# EAGLE board led_3 (EAGLE 9.4.1)
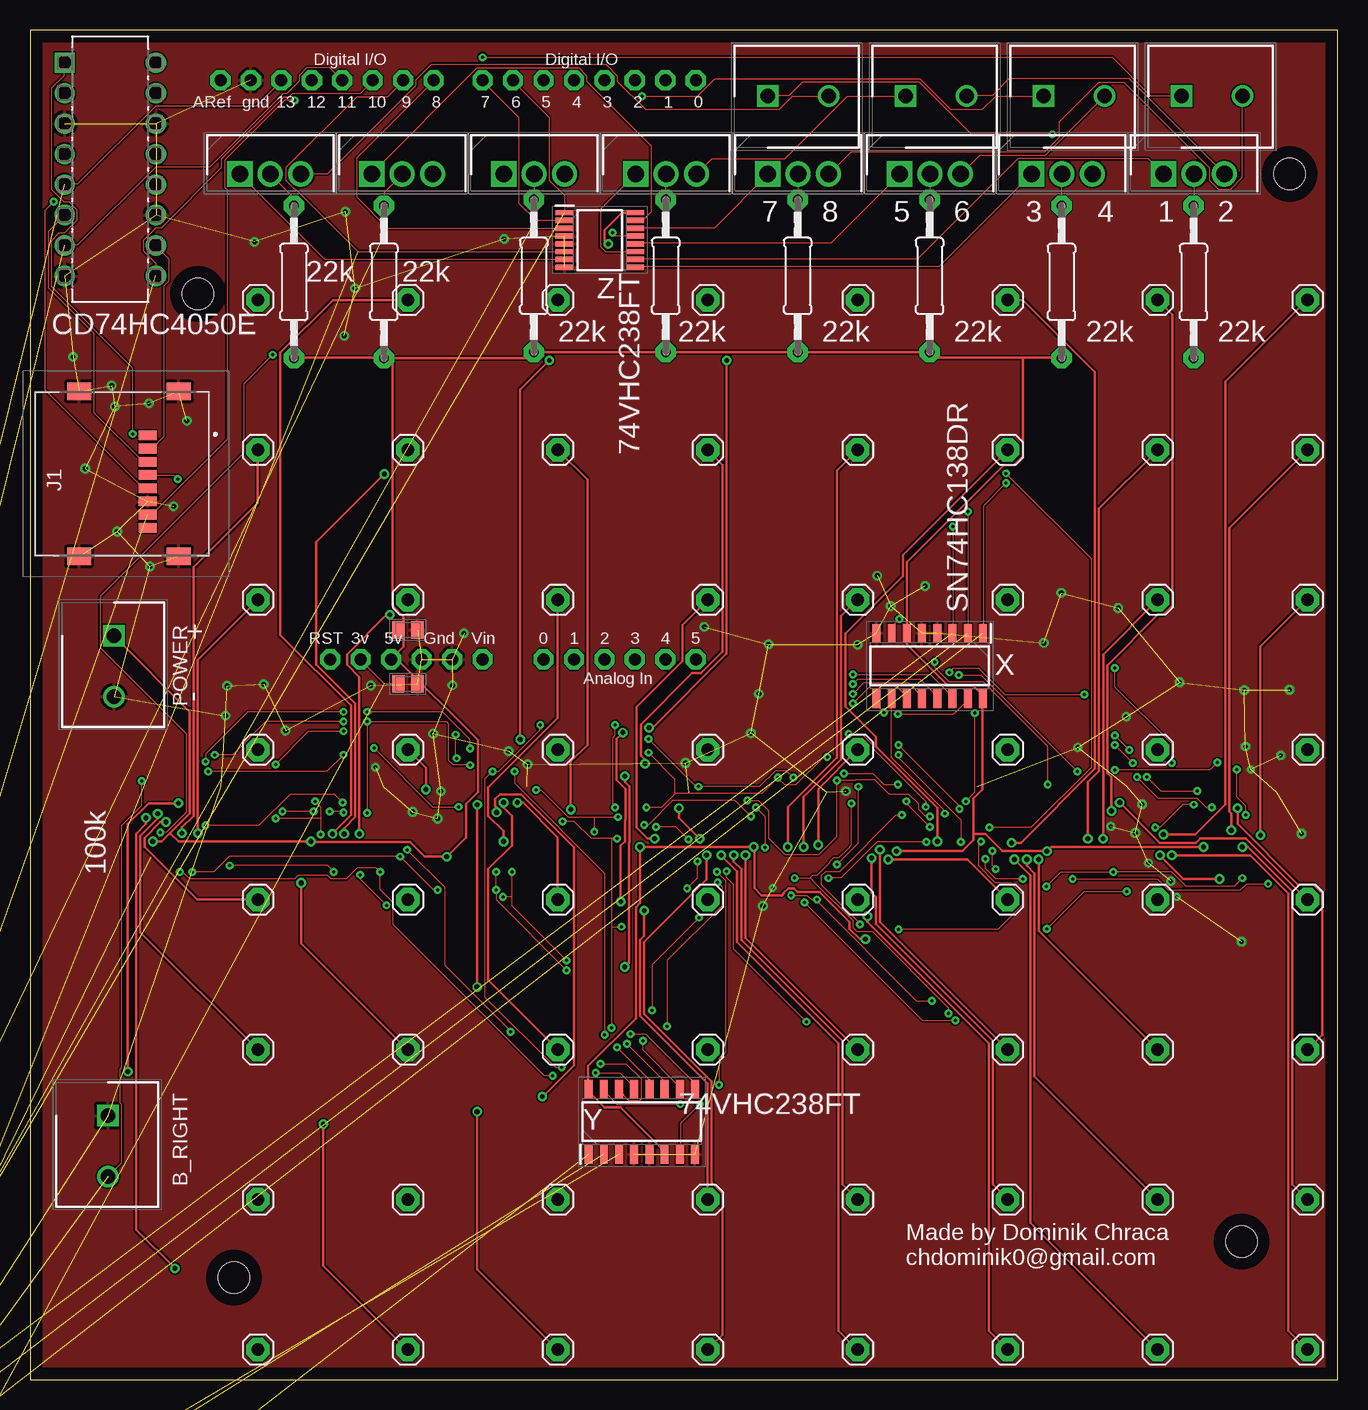
[diagram p2: board, top side]
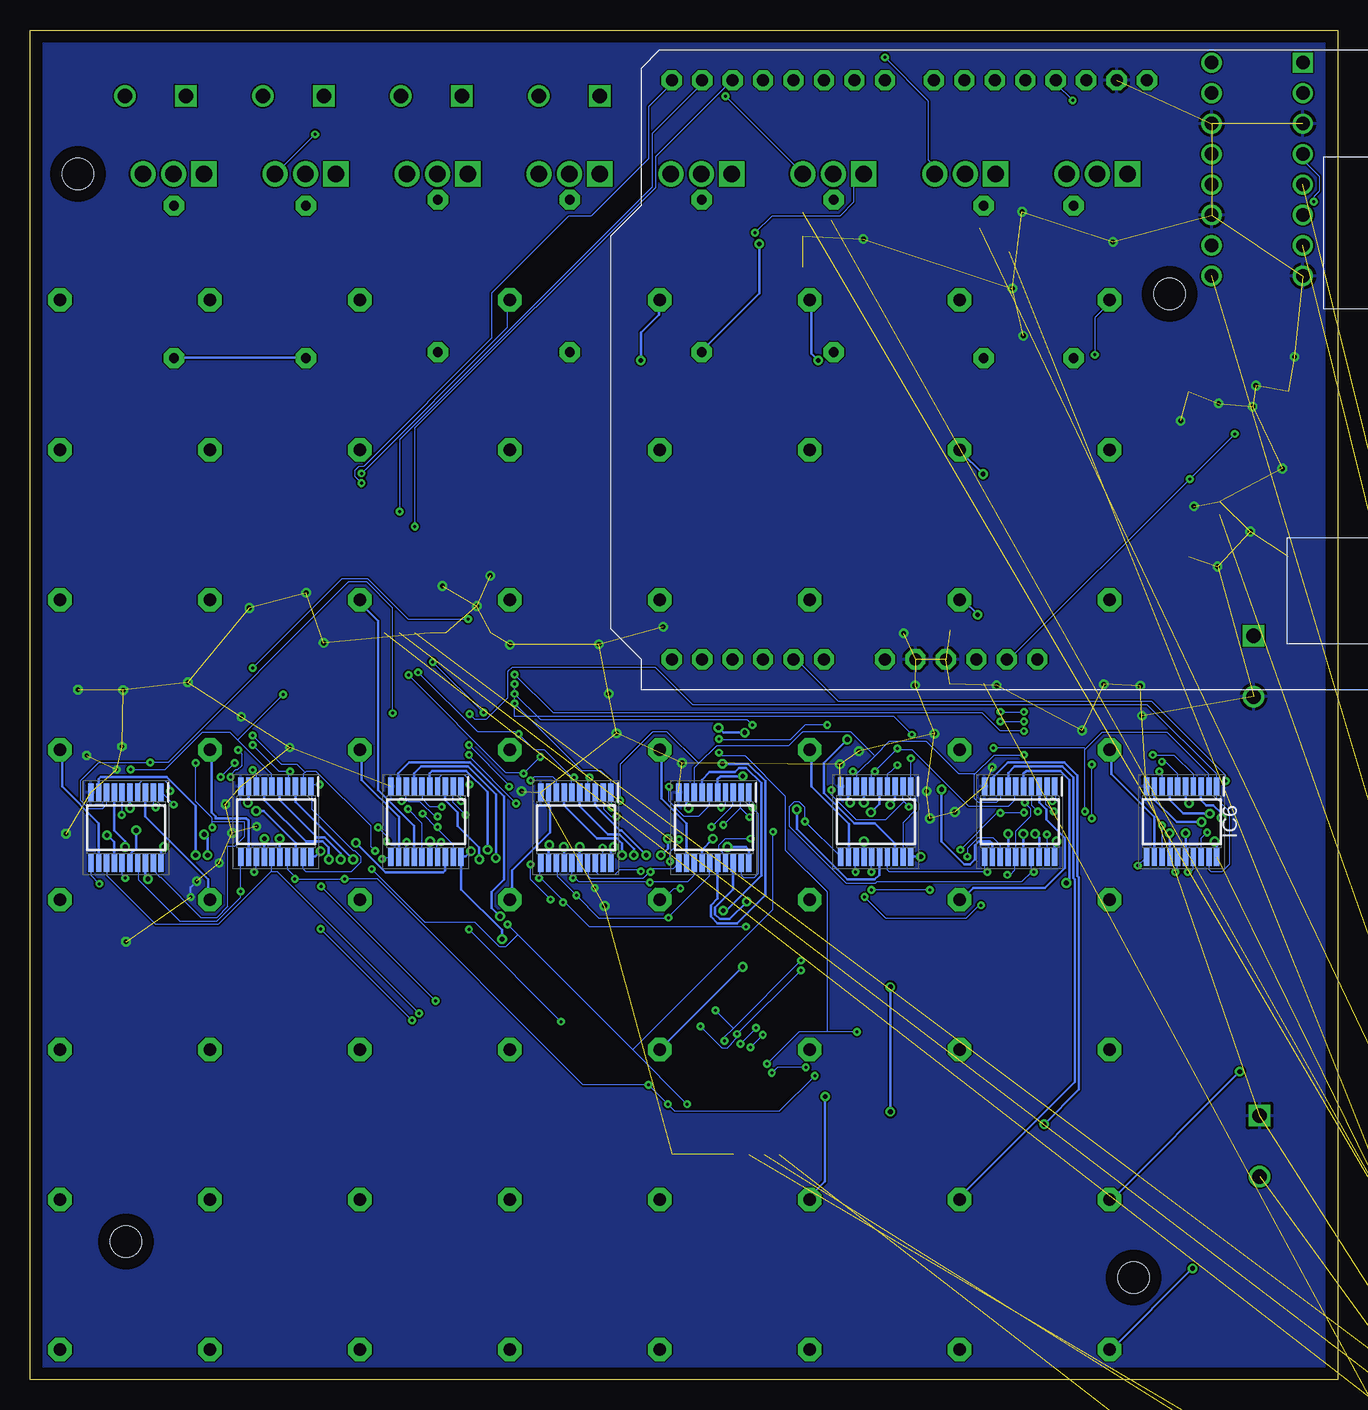
[diagram p3: board, bottom side, seen from below]

Size 109 x 112.5 mm. Coordinates in mm from the lower left corner, seen from the top.
Outline: 0,0 109,0 109,112.5 0,112.5 0,0
Copper layers (1*16): Top 0.035mm / dielectric 1.5mm / Bottom 0.035mm
Design rules "default *": minimum track width 3.5mil, minimum drill 0.2mm, track to track 4mil, track to pad 6mil, pad to pad 6mil, via to via 6mil, smd to smd 6mil, copper to edge 40mil, drill to drill 6mil, minimum pad ring 10mil, minimum via ring 8mil, stop-mask expansion 4mil, vias tented up to drill 0mil, thermal gap 10mil
Net classes: 0 40mA<: width 0.102 mm, drill 0.25 mm, clearance 0.13 mm; 1 VCC: width 0.203 mm, drill 0.4 mm, clearance 0.13 mm; 2 min: drill 0.22 mm
Holes 2.6 mm at 17,8.5 101,11.5 105,100.5 14,90.5

## Footprints (pad centres in the part's own frame; a part is rotated, then mirrored left to right if it is on the bottom)
SHDR2W100P0X508_1X2_1016X820X1 = drill 1.2 pad 1.8 square: 1 0,0 | drill 1.2 pad 1.8: 2 5.08,0
CAPC2012X88N = smd 1.02 x 1.47: 1 -0.8,0; 2 0.8,0
SOIC127P600X175-16N = smd 1.55 x 0.65: 1 -2.725,4.445; 2 -2.725,3.175; 3 -2.725,1.905; 4 -2.725,0.635; 5 -2.725,-0.635; 6 -2.725,-1.905; 7 -2.725,-3.175; 8 -2.725,-4.445; 9 2.725,-4.445; 10 2.725,-3.175; 11 2.725,-1.905; 12 2.725,-0.635; 13 2.725,0.635; 14 2.725,1.905; 15 2.725,3.175; 16 2.725,4.445
SOP65P640X120-20N = smd 1.475 x 0.45: 1 -2.938,2.925; 2 -2.938,2.275; 3 -2.938,1.625; 4 -2.938,0.975; 5 -2.938,0.325; 6 -2.938,-0.325; 7 -2.938,-0.975; 8 -2.938,-1.625; 9 -2.938,-2.275; 10 -2.938,-2.925; 11 2.938,-2.925; 12 2.938,-2.275; 13 2.938,-1.625; 14 2.938,-0.975; 15 2.938,-0.325; 16 2.938,0.325; 17 2.938,0.975; 18 2.938,1.625; 19 2.938,2.275; 20 2.938,2.925
DIP254P762X508-16 = drill 1.118 pad 1.676 square: 1 -7.62,17.78 | drill 1.118 pad 1.676: 2 -7.62,15.24; 3 -7.62,12.7; 4 -7.62,10.16; 5 -7.62,7.62; 6 -7.62,5.08; 7 -7.62,2.54; 8 -7.62,0; 9 0,0; 10 0,2.54; 11 0,5.08; 12 0,7.62; 13 0,10.16; 14 0,12.7; 15 0,15.24; 16 0,17.78
SOP65P640X120-16N = smd 1.475 x 0.45: 1 -2.938,2.275; 2 -2.938,1.625; 3 -2.938,0.975; 4 -2.938,0.325; 5 -2.938,-0.325; 6 -2.938,-0.975; 7 -2.938,-1.625; 8 -2.938,-2.275; 9 2.938,-2.275; 10 2.938,-1.625; 11 2.938,-0.975; 12 2.938,-0.325; 13 2.938,0.325; 14 2.938,0.975; 15 2.938,1.625; 16 2.938,2.275
DIP1016W53P254L3468H457Q28N = drill 0.733 pad 1.133 square: 1 -5.08,16.51 | drill 0.733 pad 1.133: 2 -5.08,13.97; 3 -5.08,11.43; 4 -5.08,8.89; 5 -5.08,6.35; 6 -5.08,3.81; 7 -5.08,1.27; 8 -5.08,-1.27; 9 -5.08,-3.81; 10 -5.08,-6.35; 11 -5.08,-8.89; 12 -5.08,-11.43; 13 -5.08,-13.97; 14 -5.08,-16.51; 15 5.08,-16.51; 16 5.08,-13.97; 17 5.08,-11.43; 18 5.08,-8.89; 19 5.08,-6.35; 20 5.08,-3.81; 21 5.08,-1.27; 22 5.08,1.27; 23 5.08,3.81; 24 5.08,6.35; 25 5.08,8.89; 26 5.08,11.43; 27 5.08,13.97; 28 5.08,16.51
472192001 = smd 0.8 x 1.5: 1 3.205,-1.8; 2 2.105,-1.8; 3 1.005,-1.8; 4 -0.095,-1.8; 5 -1.195,-1.8; 6 -2.295,-1.8; 7 -3.395,-1.8; 8 -4.495,-1.8 | smd 1.45 x 2: 9 -6.875,-4.4; 10 -6.875,3.9; 11 6.875,3.9; 12 6.875,-4.4
1X01 = drill 1.016 pad 1.93 octagon: 1 0,0
TO254P465X1024X2050-3P = drill 1.39 pad 2.085 square: 1 0,0 | drill 1.39 pad 2.085: 2 2.54,0; 3 5.08,0
0207/12 = drill 0.813 pad 1.676 octagon: 1 -6.35,0; 2 6.35,0
M0805 = smd 1.3 x 1.6: 1 -0.95,0; 2 0.95,0
SOT23(M5) = smd 0.68 x 1.02: 1 0.95,3.13; 2 0,3.13; 3 -0.95,3.13; 4 -0.95,0; 5 0.95,0
ARDUINO-NOHOLE = drill 1 pad 1.676 octagon: 3V 35.56,2.54; 5V 38.1,2.54; A0 50.8,2.54; A1 53.34,2.54; A2 55.88,2.54; A3 58.42,2.54; A4 60.96,2.54; A5 63.5,2.54; AREF 23.876,50.8; D0 63.5,50.8; D1 60.96,50.8; D2 58.42,50.8; D3 55.88,50.8; D4 53.34,50.8; D5 50.8,50.8; D6 48.26,50.8; D7 45.72,50.8; D8 41.656,50.8; D9 39.116,50.8; D10 36.576,50.8; D11 34.036,50.8; D12 31.496,50.8; D13 28.956,50.8; GND 26.416,50.8; GND1 43.18,2.54; GND2 40.64,2.54; RESET 33.02,2.54; VIN 45.72,2.54

## Placement (x,y rotation side)
B_RIGHT  282837-2  [SHDR2W100P0X508_1X2_1016X820X1]  6.5,22 270 top
C4  0.1uF  [CAPC2012X88N]  31.5,58 0 top
C5  0.1uF  [CAPC2012X88N]  31.5,62.5 0 top
IC1  SN74HC138DR  [SOIC127P600X175-16N]  75,59.5 270 top
IC2  SN74HC138DR  [SOIC127P600X175-16N]  51,21.5 90 top
IC3  SN74AHC244PWR  [SOP65P640X120-20N]  101,46 270 bottom
IC4  SN74AHC244PWR  [SOP65P640X120-20N]  76,46.5 270 bottom
IC5  SN74AHC244PWR  [SOP65P640X120-20N]  52,46 270 bottom
IC6  SN74AHC244PWR  [SOP65P640X120-20N]  13,46.5 270 bottom
IC7  SN74AHC244PWR  [SOP65P640X120-20N]  88.5,46.5 270 bottom
IC8  SN74AHC244PWR  [SOP65P640X120-20N]  63.5,46 270 bottom
IC9  SN74AHC244PWR  [SOP65P640X120-20N]  38.5,46.5 270 bottom
IC10  SN74AHC244PWR  [SOP65P640X120-20N]  26.5,46.5 270 bottom
IC11  CD74HC4050E  [DIP254P762X508-16]  10.5,92 0 top
IC12  74VHC238FT  [SOP65P640X120-16N]  47.5,95 0 top
IC13  ATMEGA328-PU  [DIP1016W53P254L3468H457Q28N]  -39,-42.5 0 top  (outside the outline)
J1  47219-2001  [472192001]  8,75.5 90 top
JP1  [1X01]  19,90 0 top
JP2  [1X01]  31.5,90 0 top
JP3  [1X01]  44,90 0 top
JP4  [1X01]  56.5,90 0 top
JP5  [1X01]  44,77.5 0 top
JP6  [1X01]  56.5,77.5 0 top
JP7  [1X01]  44,65 0 top
JP8  [1X01]  56.5,65 0 top
JP9  [1X01]  44,52.5 0 top
JP10  [1X01]  56.5,52.5 0 top
JP11  [1X01]  44,40 0 top
JP12  [1X01]  56.5,40 0 top
JP13  [1X01]  44,27.5 0 top
JP14  [1X01]  56.5,27.5 0 top
JP15  [1X01]  44,15 0 top
JP16  [1X01]  56.5,15 0 top
JP17  [1X01]  44,2.5 0 top
JP18  [1X01]  56.5,2.5 0 top
JP19  [1X01]  19,77.5 0 top
JP20  [1X01]  31.5,77.5 0 top
JP21  [1X01]  69,90 0 top
JP22  [1X01]  81.5,90 0 top
JP23  [1X01]  69,77.5 0 top
JP24  [1X01]  81.5,77.5 0 top
JP25  [1X01]  69,65 0 top
JP26  [1X01]  81.5,65 0 top
JP27  [1X01]  69,52.5 0 top
JP28  [1X01]  81.5,52.5 0 top
JP29  [1X01]  69,40 0 top
JP30  [1X01]  81.5,40 0 top
JP31  [1X01]  69,27.5 0 top
JP32  [1X01]  81.5,27.5 0 top
JP33  [1X01]  69,15 0 top
JP34  [1X01]  81.5,15 0 top
JP35  [1X01]  69,2.5 0 top
JP36  [1X01]  81.5,2.5 0 top
JP37  [1X01]  19,65 0 top
JP38  [1X01]  31.5,65 0 top
JP39  [1X01]  94,90 0 top
JP40  [1X01]  106.5,90 0 top
JP41  [1X01]  94,77.5 0 top
JP42  [1X01]  106.5,77.5 0 top
JP43  [1X01]  94,65 0 top
JP44  [1X01]  106.5,65 0 top
JP45  [1X01]  94,52.5 0 top
JP46  [1X01]  19,52.5 0 top
JP47  [1X01]  31.5,52.5 0 top
JP48  [1X01]  106.5,52.5 0 top
JP49  [1X01]  106.5,40 0 top
JP50  [1X01]  94,40 0 top
JP51  [1X01]  94,27.5 0 top
JP52  [1X01]  106.5,27.5 0 top
JP53  [1X01]  94,15 0 top
JP54  [1X01]  106.5,15 0 top
JP55  [1X01]  19,40 0 top
JP56  [1X01]  31.5,40 0 top
JP57  [1X01]  94,2.5 0 top
JP58  [1X01]  106.5,2.5 0 top
JP64  [1X01]  19,27.5 0 top
JP65  [1X01]  31.5,27.5 0 top
JP73  [1X01]  19,15 0 top
JP74  [1X01]  31.5,15 0 top
JP82  [1X01]  19,2.5 0 top
JP83  [1X01]  31.5,2.5 0 top
L_1_2  282837-2  [SHDR2W100P0X508_1X2_1016X820X1]  96,107 0 top
L_3_4  282837-2  [SHDR2W100P0X508_1X2_1016X820X1]  84.5,107 0 top
L_5_6  282837-2  [SHDR2W100P0X508_1X2_1016X820X1]  73,107 0 top
L_7_8  282837-2  [SHDR2W100P0X508_1X2_1016X820X1]  61.5,107 0 top
POWER  282837-2  [SHDR2W100P0X508_1X2_1016X820X1]  7,62 270 top
Q9  IRF610PBF  [TO254P465X1024X2050-3P]  28.5,100.5 0 top
Q10  IRF610PBF  [TO254P465X1024X2050-3P]  17.5,100.5 0 top
Q11  IRF610PBF  [TO254P465X1024X2050-3P]  61.5,100.5 0 top
Q12  IRF610PBF  [TO254P465X1024X2050-3P]  39.5,100.5 0 top
Q13  IRF610PBF  [TO254P465X1024X2050-3P]  83.5,100.5 0 top
Q14  IRF610PBF  [TO254P465X1024X2050-3P]  94.5,100.5 0 top
Q15  IRF610PBF  [TO254P465X1024X2050-3P]  50.5,100.5 0 top
Q16  IRF610PBF  [TO254P465X1024X2050-3P]  72.5,100.5 0 top
R1  330  [0207/12]  97,91.5 90 top
R2  330  [0207/12]  53,92 90 top
R3  330  [0207/12]  64,92 90 top
R4  330  [0207/12]  29.5,91.5 90 top
R5  330  [0207/12]  22,91.5 90 top
R6  330  [0207/12]  86,91.5 90 top
R7  330  [0207/12]  75,92 90 top
R8  330  [0207/12]  42,92 90 top
R9  10k  [M0805]  -44,-63.5 0 top  (outside the outline)
R10  10k+  [M0805]  -25,-54.5 0 top  (outside the outline)
U$1  MIC5501  [SOT23(M5)]  -42,-72.5 0 top  (outside the outline)
U$2  ARDUINO-NOHOLE  [ARDUINO-NOHOLE]  -8,57.5 0 top

## Tracks (layer width: path | path; a pad name or v marks a point on that pad's centre or on a via)
3V  (via drill 0.25)  (1 unrouted)
  Top 0.102: C4.1 31.16,58.03 29.54,58.03 27.57,59.99 U$2.3V | v12.32,75.08 12.03,75.37 9.83,75.37 J1.4 | v8.56,78.83 8.56,84.32 1.8,91.08 1.8,94.95 2.44,95.59 2.9,95.59 3.94,96.63 3.94,97.5 3.3,98.13 2.84,98.13 1.8,99.17 1.8,107.67 2.84,108.71 2.84,109.75 IC11.1
  Bottom 0.102: U$2.3V 27.52,60.05 27.34,60.05 v12.32,75.08 v8.56,78.83
5V  (via drill 0.4)  (6 unrouted)
  Top 0.203: IC2.6 52.88,18.8 52.88,19.03 49.24,22.67 47.91,22.67 46.64,23.94 46.64,24.17 IC2.16 46.53,24.23 46.53,26.13 50.51,30.12 50.51,39.37 50.86,39.71 v50.86,44.39 50.92,44.39 v60.34,44.39 60.39,44.34 60.39,40.98 61,40.37 62.7,40.37 62.88,40.55 62.88,40.59 63.22,40.93 63.7,40.93 63.99,40.64 65.83,40.64 68.31,38.15 68.31,37.58 69.18,36.71 v69.64,36.71 | v72.24,44.05 77.73,44.05 78.65,44.97 78.65,45.49 | 78.65,45.49 78.65,48.44 79.41,49.19 79.41,56.76 IC1.16 79.46,56.88 79.46,56.99 78.6,57.86 76.52,57.86 73.11,61.27 73.11,62.19 IC1.6 73.11,62.31 73.11,68.14 81.2,76.23 82.01,76.23 82.76,76.98 82.76,85.13 82.76,85.19 | 78.65,45.49 78.71,45.49 79.64,45.49 81.08,44.05 v84.78,44.05 84.84,44.1 85.13,44.39 v97.84,44.39 | v10.24,44.86 10.99,44.86 11.68,45.55 | 11.68,45.55 13.3,47.17 13.3,55.66 7,61.96 POWER.1 | 11.68,45.55 11.74,45.49 12.38,44.86 v23.41,44.86 23.47,44.8 31.67,44.8 32.89,43.59 v34.74,43.59 34.8,43.64 36.36,45.2 36.36,47.98 37.34,48.96 37.34,53.29 30.4,60.23 U$2.5V 30.12,60.05 31.16,61.09 31.16,62.48 C5.1 31.16,62.6 31.16,63.58 30.23,64.5 30.23,85.07 R4.1 | R5.1 22.02,85.19 29.48,85.19 R4.1 | v48.2,94.67 47.91,94.95 47.91,95.82 49.36,97.27 50.4,97.27 IC12.16 | 82.76,85.19 75.48,85.19 75.07,85.59 R7.1 74.96,85.65 64.09,85.65 R3.1 63.98,85.65 53.06,85.65 R2.1 42.02,85.65 R8.1 41.9,85.65 41.38,85.13 29.59,85.13 R4.1 | 82.76,85.19 85.99,85.19 R6.1
  Bottom 0.203: v50.86,44.39 49.3,44.39 49.07,44.16 IC5.20 | v60.34,44.39 60.57,44.16 60.57,43.06 IC8.20 | v72.24,44.05 72.7,43.59 73.05,43.59 IC4.20 73.05,43.47 73.05,40.87 69.64,37.46 v69.64,36.71 | v84.78,44.05 85.24,43.59 85.53,43.59 IC7.20 | v97.84,44.39 98.07,44.16 IC3.20 | v10.24,44.86 10.06,44.68 10.06,43.59 IC6.20 | v23.41,44.86 23.59,44.68 23.59,43.59 IC10.20 | v34.74,43.59 35.55,43.59 IC9.20 | v48.2,94.67 48.2,90.56 53,85.77 R2.1 | R1.1 96.97,85.19 86.05,85.19 R6.1
CLK  (1 unrouted)
  Top 0.102: IC11.5 2.9,99.64 3.94,99.64 10.47,106.17 18.85,106.17 20.93,108.25 U$2.D13
CS  (1 unrouted)
  Top 0.102: IC11.9 10.47,92.01 10.47,93.05 9.43,94.09 9.43,94.95 10.47,96 10.93,96 15.96,101.02 15.96,101.72 21.16,106.92 21.56,106.92 21.85,107.2 27.52,107.2 28.55,108.25 U$2.D10
DATA_OUT  (1 unrouted)
  Top 0.102: IC12.6 27.34,94.03 22.14,99.23 22.08,99.23 21.33,99.98 21.33,101.02 27.23,106.92 29.77,106.92 31.1,108.25 U$2.D9
DI  (1 unrouted)
  Top 0.102: IC11.7 2.9,94.55 3.94,94.55 10.47,101.08 14.98,101.08 21.1,107.2 21.39,107.2 22.43,108.25 22.43,108.71 23.07,109.34 24.97,109.34 26.01,108.3 U$2.D11
DO  (via drill 0.25)  (1 unrouted)
  Top 0.102: v22.08,106.63 21.22,106.63 16.25,101.66 16.25,99.35 16.42,99.17 16.42,78.37 10.18,72.13 9.83,72.13 J1.7
  Bottom 0.102: v22.08,106.63 23.47,108.01 23.47,108.25 U$2.D12
EX0  (1 unrouted)
EX1  (1 unrouted)
EX2  (1 unrouted)
EY0  (1 unrouted)
EY1  (1 unrouted)
EY2  (1 unrouted)
GND  (via drill 0.25, 0.3, 0.35, 0.4)  (93 unrouted)
  Bottom 0.152: v95.62,40.23 95.62,41.04 v95.11,41.55
  other vias: 104.27,52.02 101.33,52.78 101.78,50.87 91.38,55.25 87.35,52.7 93.24,43.07 92.15,45.56 90.11,46.11 92.72,47.96 101,36.5 106,45.5 105,57.5 101.23,57.46 95.84,58.12 90.72,64.31 85.98,65.58 84.53,61.4 74.62,66.15 70.64,67.01 71.75,64.48 68.99,61.26 56.22,62.74 61.57,61.29 60.76,57.16 60.1,53.88 54.65,51.4 41.48,51.28 39.89,52.38 35.22,57.87 36.17,62.2 28.41,57.85 16.44,57.82 16.3,55.33 19.48,57.97 21.3,54.11 33.61,53.84 28.8,51.03 34.25,49.04 33.98,46.77 31.89,47.32 61.92,40.97 68.01,49.04 61.1,39.48 10,67.78 7.27,70.68 11.97,72.79 13.07,79.92 9.92,81.37 7.07,81.1 4.6,75.93 3.58,85.25 6.8,82.86 39.53,95.08 26.3,97.36 18.72,94.83 26.19,87.01 27.1,90.96
  pour Top: -25,122.5 -25,3.5 14,-35.5 120,-35.5 169,13.5 169,94.5 122,141.5 -6,141.5
  pour Bottom: -33,140.5 -33,15.5 28,-45.5 110,-45.5 161,5.5 161,60.5 94,127.5 81,140.5
LAYER1
  Top 0.102: IC12.15 50.45,96.63 51.09,96.63 51.78,97.32 51.78,102.87 46.41,108.25 46.41,108.71 45.77,109.34 37.28,109.34 28.55,100.62 28.55,100.5 Q9.1
LAYER2
  Top 0.102: IC12.14 50.45,96 57.04,96 61.49,100.44 Q11.1
LAYER3  (via drill 0.25)
  Top 0.102: v48.55,95.59 48.78,95.36 50.4,95.36 IC12.13
  Bottom 0.102: v48.55,95.59 47.16,96.98 41.5,96.98 40.34,98.13 40.34,99.64 39.53,100.44 Q12.1
LAYER4
  Top 0.102: IC12.12 50.45,94.72 66.75,94.72 72.47,100.44 Q16.1
LAYER5
  Top 0.102: IC12.11 50.4,94.03 47.97,94.03 47.57,94.44 47.57,97.56 50.45,100.44 Q15.1
LAYER6
  Top 0.102: IC12.10 50.45,93.39 73.97,93.39 82.35,101.77 93.22,101.77 94.49,100.5 Q14.1
LAYER7
  Top 0.102: IC12.9 50.45,92.76 75.77,92.76 83.45,100.44 Q13.1
LAYER8
  Top 0.102: IC12.7 44.56,93.39 24.57,93.39 17.52,100.44 Q10.1
N$1  (via drill 0.25)
  Top 0.102: v71.2,55.6 70.56,56.24 IC1.9 | v75.42,59.82 75.42,59.36 76.63,58.15 79.46,58.15 84.84,52.77 v84.84,49.59
  Bottom 0.102: IC7.19 86.22,43.53 86.22,42.55 85.99,42.31 82.24,42.31 81.43,43.12 81.43,43.59 81.95,44.1 82.06,44.1 85.53,47.57 85.53,49.42 IC7.1 85.53,49.48 85.42,49.59 v84.84,49.59 | v75.42,59.82 v71.2,55.6
N$3  (via drill 0.25)
  Top 0.102: v10.87,45.61 11.34,45.61 13.01,47.28 13.01,53.87 5.85,61.04 5.85,65.25 17.81,77.22 17.81,82.99 v20.23,85.42
  Bottom 0.102: v10.87,45.61 11.39,45.09 11.39,43.59 IC6.18 | v20.23,85.42 20.23,88.54 19.02,89.75 19.02,89.99 JP1.1
N$5  (via drill 0.4)
  Top 0.203: v12.66,45.55 12.66,46.01 13.65,46.99 13.65,67.74 18.96,73.06 18.96,77.45 JP19.1
  Bottom 0.203: v12.66,45.55 12.66,43.59 IC6.16
N$6  (via drill 0.4)
  Top 0.203: v13.99,45.55 13.99,59.99 18.96,64.97 JP37.1
  Bottom 0.203: v13.99,45.55 13.99,43.59 IC6.14
N$7
  Bottom 0.203: IC6.12 15.27,43.59 15.27,46.88 18.85,50.46 18.85,52.37 18.96,52.48 JP46.1
N$8  (via drill 0.4)
  Top 0.203: v11.34,46.47 10.87,46.47 9.54,45.15 9.54,44.39 13.94,40 18.96,40 JP55.1
  Bottom 0.203: v11.34,46.47 13.42,46.47 15.27,48.32 15.27,49.42 IC6.9
N$9  (via drill 0.4)
  Top 0.203: v10.64,47.17 10.64,46.76 9.2,45.32 9.2,37.29 18.96,27.52 JP64.1
  Bottom 0.203: v10.64,47.17 12.84,47.17 13.99,48.32 13.99,49.42 IC6.7
N$10  (via drill 0.4)
  Top 0.203: v12.38,48.03 9.89,48.03 8.16,46.3 v8.16,25.67
  Bottom 0.203: v12.38,48.03 12.66,48.32 12.66,49.42 IC6.5 | v8.16,25.67 18.79,15.04 18.96,15.04 JP73.1
N$12  (via drill 0.25)
  Top 0.102: v76.92,71.09 76.92,62.25
  Bottom 0.102: v76.92,71.09 76.92,79.3 56.87,99.35 56.87,101.95 50.57,108.25 50.45,108.25 U$2.D2
N$13  (via drill 0.25)
  Top 0.102: v78.19,72.36 78.19,62.25
  Bottom 0.102: v78.19,72.36 78.19,78.37 57.16,99.4 57.16,103.85 53,108.01 53,108.25 U$2.D1
N$14  (via drill 0.25)
  Top 0.102: 79.46,62.25 79.46,72.82 v81.37,74.73
  Bottom 0.102: v81.37,74.73 81.95,75.31 81.95,75.77 81.6,76.12 81.2,76.12 70.51,86.81 70.51,90.56 64.09,96.98 62.24,96.98 57.45,101.77 57.45,106.11 55.54,108.01 55.54,108.25 U$2.D0
N$15  (1 unrouted)
N$16
  Top 0.102: R4.2 29.54,97.9 29.54,98.94 31.04,100.44 Q9.2
N$17
  Top 0.102: R3.2 64.03,98.36 64.03,100.44 Q11.2
N$18
  Top 0.102: R8.2 42.02,98.36 42.02,100.44 Q12.2
N$19
  Top 0.102: R7.2 75.01,98.36 75.01,100.44 Q16.2
N$20
  Top 0.102: R2.2 53,98.36 53,100.44 Q15.2
N$21
  Top 0.102: R1.2 97.03,97.9 97.03,100.44 Q14.2
N$22
  Top 0.102: R6.2 85.99,97.9 85.99,100.44 Q13.2
N$23
  Top 0.102: R5.2 21.97,97.9 21.97,98.54 20.06,100.44 Q10.2
N$24  (via drill 0.25)
  Top 0.102: v37.74,110.21 90.21,110.21 93.39,107.03 95.99,107.03 L_1_2.1
  Bottom 0.102: v37.74,110.21 34.1,106.57 34.1,101.66 33.58,101.14 Q9.3
N$25
  Top 0.102: L_1_2.2 101.07,106.97 101.07,100.21 100.09,99.23 99.05,99.23 98.3,99.98 98.3,101.02 91.19,108.13 89.11,108.13 85.82,104.84 85.82,103.56 84.61,102.35 68.48,102.35 66.64,100.5 Q11.3
N$26  (via drill 0.25)
  Top 0.102: v51.03,106.97 55.66,106.97 57.1,108.42 74.2,108.42 76.75,105.88 79.41,105.88 80.5,106.97 84.49,106.97 L_3_4.1
  Bottom 0.102: v51.03,106.97 44.56,100.5 Q12.3
N$27
  Top 0.102: L_3_4.2 89.58,106.97 84.66,102.06 79.17,102.06 77.61,100.5 Q16.3
N$28
  Top 0.102: L_5_6.1 72.99,106.97 68.14,106.97 62.94,101.77 56.87,101.77 55.6,100.5 Q15.3
N$29
  Top 0.102: L_5_6.2 78.13,107.03 80.21,107.03 81.6,108.42 91.66,108.42 Q14.3
N$30  (via drill 0.25)
  Top 0.102: v85.24,103.8 78.48,103.8 74.15,108.13 64.38,108.13 63.28,107.03 61.55,107.03 L_7_8.1
  Bottom 0.102: v85.24,103.8 88.53,100.5 Q13.3
N$31
  Top 0.102: L_7_8.2 66.58,106.97 63.57,106.97 62.47,105.88 51.32,105.88 48.95,108.25 48.95,108.71 48.03,109.63 33.47,109.63 32.2,108.36 32.2,107.9 24.8,100.5 22.6,100.5 Q10.3
N$32  (via drill 0.4)
  Top 0.203: v9.66,46.82 9.66,46.3 8.85,45.49 8.85,12.5 v12.09,9.26
  Bottom 0.203: v9.66,46.82 9.66,47.17 10.35,47.86 10.93,47.86 11.39,48.32 11.39,49.42 IC6.3 | v12.09,9.26 18.85,2.5 18.96,2.5 JP82.1
N$33  (via drill 0.4)
  Top 0.203: v25.2,45.49 26.76,47.05 26.76,56.18 20.87,62.08 20.87,85.59 25.26,89.99 31.44,89.99 JP2.1
  Bottom 0.203: v25.2,45.49 24.86,45.15 24.86,43.59 IC10.18
N$34  (via drill 0.4)
  Top 0.203: v26.19,45.49 26.19,45.95 27.11,46.88 27.11,56.35 23.88,59.59 23.88,69.82 v29.54,75.48
  Bottom 0.203: v26.19,45.49 26.19,43.59 IC10.16 | v29.54,75.48 31.5,77.45 JP20.1
N$35  (via drill 0.4)
  Top 0.203: v27.46,45.49 27.46,58.55 26.42,59.59 26.42,60.46 29.71,63.75 v30,63.75
  Bottom 0.203: v27.46,45.49 27.46,43.59 IC10.14 | v30,63.75 31.21,64.97 31.44,64.97 JP38.1
N$36  (via drill 0.4)
  Top 0.203: v33,49.19 33,50.98 31.5,52.48 JP47.1
  Bottom 0.203: v33,49.19 33,44.86 31.1,42.95 30.63,42.95 30.23,43.35 30.23,44.51 29.88,44.86 28.96,44.86 28.79,44.68 28.79,43.59 IC10.12
N$37
  Bottom 0.203: IC10.3 24.86,49.42 24.86,48.09 24.28,47.51 24.28,46.7 22.72,45.15 22.72,42.66 24.39,40.98 30.35,40.98 31.33,40 31.44,40 JP56.1
N$38  (via drill 0.4)
  Top 0.203: v22.6,41.39 22.6,36.36 31.44,27.52 JP65.1
  Bottom 0.203: v22.6,41.39 22.37,41.62 22.37,50 23.12,50.75 25.95,50.75 26.19,50.52 26.19,49.48 IC10.5
N$39
  Bottom 0.203: IC10.7 27.46,49.48 27.46,50.58 26.94,51.1 22.95,51.1 22.02,50.17 22.02,41.79 21.91,41.68 21.91,24.8 31.44,15.27 31.44,15.04 JP74.1
N$40  (via drill 0.4)
  Top 0.203: v24.45,21.28 24.45,9.49 31.44,2.5 JP83.1
  Bottom 0.203: v24.45,21.28 21.56,24.17 21.56,41.85 21.68,41.97 21.68,50.34 22.78,51.44 27.47,51.44 28.73,50.19 28.73,49.48 IC10.9
N$41  (via drill 0.4)
  Top 0.203: v40.86,53.35 40.86,82.53 v43.29,84.96
  Bottom 0.203: v40.86,53.35 42.83,51.39 42.83,48.9 40.28,46.36 38.55,46.36 36.88,44.68 36.88,43.59 IC9.18 | v43.29,84.96 43.87,85.54 43.87,89.87 43.98,89.99 JP3.1
N$42  (via drill 0.4)
  Top 0.203: v45.08,47.51 45.08,51.5 46.47,52.89 46.47,75.02 44.04,77.45 JP5.1
  Bottom 0.203: v45.08,47.51 45.08,45.9 40.86,41.68 38.61,41.68 38.2,42.08 38.2,43.53 IC9.16
N$43  (via drill 0.4)
  Top 0.203: v39.48,44.86 39.48,45.72 38.2,46.99 38.2,49.36 43.98,55.14 43.98,64.97 JP7.1
  Bottom 0.203: v39.48,44.86 39.48,43.59 IC9.14
N$44
  Bottom 0.203: IC9.12 40.75,43.59 40.75,46.3 43.87,49.42 43.87,52.37 43.98,52.48 JP9.1
N$45  (via drill 0.4)
  Top 0.203: v40.63,48.09 41.09,48.09 43.98,45.2 43.98,40 JP11.1
  Bottom 0.203: v40.63,48.09 40.63,48.21 40.8,48.38 40.8,48.61 40.75,48.67 40.75,49.42 IC9.9
N$46  (via drill 0.4)
  Top 0.203: v39.48,48.09 39.48,47.69 40.17,46.99 40.17,44.51 38.2,42.55 38.2,33.3 43.98,27.52 JP13.1
  Bottom 0.203: v39.48,48.09 39.48,49.42 IC9.7
N$47  (via drill 0.4)
  Top 0.203: v38.9,47.28 38.9,47.69 38.78,47.8 38.78,48.38 39.19,48.78 40.92,48.78 45.37,44.34 45.37,26.19 42.77,23.59 v42.71,23.59
  Bottom 0.203: v38.9,47.28 38.2,47.98 38.2,49.42 IC9.5 | v42.71,23.59 42.71,16.54 43.98,15.27 43.98,15.04 JP15.1
N$48  (via drill 0.4)
  Top 0.203: v37.28,32.72 v37.28,47.92 | v37.28,22.32 37.28,9.2 43.98,2.5 JP17.1
  Bottom 0.203: v37.28,47.92 36.88,48.32 36.88,49.42 IC9.3 | v37.28,22.32 v37.28,32.72
N$49  (via drill 0.4)
  Top 0.203: v49.24,39.83 49.24,44.51 49.59,44.86 49.59,46.59 49.65,46.65 49.65,49.25 48.9,50 48.9,53.41 v49.41,53.93 | v51.61,54.33 51.9,54.33 58.08,60.52 v58.08,84.96
  Bottom 0.203: v49.24,39.83 50.69,38.38 51.49,38.38 51.9,38.79 51.9,39.37 50.4,40.87 50.4,43.01 IC5.18 | v49.41,53.93 51.21,53.93 v51.61,54.33 | v58.08,84.96 58.08,87.27 56.58,88.77 56.58,89.93 56.52,89.99 JP4.1
N$50  (via drill 0.4)
  Top 0.203: v51.26,51.33 51.26,51.67 50.92,52.02 50.92,54.62 55.19,58.9 55.95,58.9 57.74,60.69 57.74,76.23 56.52,77.45 JP6.1
  Bottom 0.203: v51.26,51.33 49.13,51.33 47.68,49.88 47.68,40.41 50.05,38.04 51.67,38.04 52.25,38.62 52.25,39.54 51.67,40.12 51.67,43.01 IC5.16
N$51  (via drill 0.4)
  Top 0.203: v52.07,45.09 51.49,45.09 50.57,46.01 50.57,56.07 54.38,59.88 54.38,62.88 56.47,64.97 JP8.1
  Bottom 0.203: v52.07,45.09 53,44.16 53,43.06 IC5.14
N$52
  Bottom 0.203: IC5.12 54.27,46.36 56.35,48.44 56.35,52.37 56.47,52.48 JP10.1
N$53  (via drill 0.25)
  Top 0.102: v52.19,46.07 53.87,46.07 v54.91,45.03 | v55.66,43.18 55.66,41.79 v54.79,40.93
  Bottom 0.102: v52.19,46.07 50.4,47.86 50.4,48.9 IC5.3 | v54.91,45.03 54.91,44.74 55.66,43.99 v55.66,43.18 | v54.79,40.93 55.31,40.93 56.23,40 56.47,40 JP12.1
N$54  (via drill 0.4)
  Top 0.203: v49.59,50.29 49.59,49.83 49.99,49.42 49.99,44.8 49.94,44.74 49.94,34.74 v49.59,34.4
  Bottom 0.203: v49.59,50.29 51.44,50.29 51.67,50.06 51.67,48.96 IC5.5 | v49.59,34.4 56.47,27.52 JP14.1
N$55  (via drill 0.4)
  Top 0.203: v51.21,39.08 51.21,37 50.86,36.65 50.86,30.29 56.47,24.69 56.47,15.04 JP16.1
  Bottom 0.203: v51.21,39.08 50.98,39.08 48.03,42.02 48.03,49.71 49.3,50.98 49.88,50.98 50.22,50.63 52.36,50.63 53,50 53,48.96 IC5.7
N$56  (via drill 0.4)
  Top 0.203: v54.1,47.63 54.1,46.82 v55.83,45.09 | v56.41,43.7 56.41,41.68 51.21,36.48 51.21,30.47 56.81,24.86 56.81,16.43 57.74,15.5 57.74,3.71 56.52,2.5 JP18.1
  Bottom 0.203: v54.1,47.63 54.27,47.8 54.27,48.9 IC5.9 | v55.83,45.09 55.83,44.28 v56.41,43.7
N$57  (via drill 0.25)
  Top 0.102: v58.08,42.37 58.08,41.85 58.66,41.27 58.66,35.9 v64.73,29.83 | v72.41,37.52 80.68,37.52 82.7,39.54 82.7,40.46 81.72,41.45 80.44,41.45 79.06,42.83 79.06,44.62 v79.29,44.86 | v79.98,46.01 83.45,46.01 88.48,51.04 88.48,68.43 v81.37,75.54
  Bottom 0.102: v58.08,42.37 58.2,42.49 59.87,42.49 60.28,42.08 61.55,42.08 61.84,42.37 61.84,43.01 IC8.18 | v72.41,37.52 v64.73,29.83 | v79.29,44.86 79.29,45.32 v79.98,46.01 | v81.37,75.54 69.23,87.67 69.23,89.75 69,89.99 JP21.1
N$58  (via drill 0.4)
  Top 0.203: v63.17,44.39 63.17,47.74 67.27,51.85 67.27,75.77 68.95,77.45 JP23.1
  Bottom 0.203: v63.17,44.39 IC8.16
N$59  (via drill 0.4)
  Top 0.203: v64.5,44.39 64.5,48.55 67.62,51.67 67.62,63.64 68.95,64.97 JP25.1
  Bottom 0.203: v64.5,44.39 64.5,43.06 IC8.14
N$60  (via drill 0.4)
  Top 0.203: v65.71,44.57 65.71,49.25 68.95,52.48 JP27.1
  Bottom 0.203: v65.71,44.57 65.77,44.51 65.77,43.06 IC8.12
N$61
  Bottom 0.203: IC8.9 65.77,48.9 65.77,47.8 65.65,47.69 65.65,45.61 68.83,42.43 68.83,40.12 68.95,40 JP29.1
N$62  (via drill 0.4)
  Top 0.203: v59.64,43.7 59.64,36.82 68.95,27.52 JP31.1
  Bottom 0.203: v59.64,43.7 59.64,44.68 60.05,45.09 61.72,45.09 64.5,47.86 64.5,48.9 IC8.7
N$63  (via drill 0.4)
  Top 0.203: v58.66,43.7 58.66,43.18 59.3,42.55 59.3,36.65 67.73,28.21 67.73,16.25 68.95,15.04 JP33.1
  Bottom 0.203: v58.66,43.7 58.66,44.22 59.87,45.43 60.8,45.43 63.17,47.8 63.17,48.9 IC8.5
N$64  (via drill 0.4)
  Top 0.203: v57.62,43.7 58.95,42.37 58.95,36.48 67.39,28.04 67.39,4.06 68.95,2.5 JP35.1
  Bottom 0.203: v57.62,43.7 59.7,45.78 59.82,45.78 61.9,47.86 61.9,48.9 IC8.3
N$65  (via drill 0.4)
  Top 0.203: v81.83,44.74 82.58,44.74 88.77,50.92 88.77,83.98 82.76,89.99 81.54,89.99 JP22.1
  Bottom 0.203: v81.83,44.74 79.35,42.26 74.55,42.26 74.38,42.43 74.38,43.53 IC4.18
N$66  (via drill 0.4)
  Top 0.203: v75.65,44.86 75.65,47.63 70.51,52.77 70.51,53.58 67.96,56.12 67.96,62.19 72.76,66.99 72.76,68.72 81.49,77.45 JP24.1
  Bottom 0.203: v75.65,44.86 75.65,43.59 IC4.16
N$67
  Bottom 0.203: IC4.14 76.98,43.59 76.98,46.13 79.98,49.13 79.98,63.23 81.49,64.73 81.49,64.97 JP26.1
N$68
  Bottom 0.203: IC4.12 78.25,43.59 78.25,46.88 81.37,50 81.37,52.37 81.49,52.48 JP28.1
N$69  (via drill 0.4)
  Top 0.203: v71.55,43.35 78.13,43.35 81.49,40 JP30.1
  Bottom 0.203: v71.55,43.35 71.55,44.34 73.34,46.13 73.34,47.28 74.38,48.32 74.38,49.42 IC4.3
N$70  (via drill 0.4)
  Top 0.203: v70.85,44.16 70.85,38.15 81.49,27.52 JP32.1
  Bottom 0.203: v70.85,44.16 70.85,48.96 72.64,50.75 75.48,50.75 75.71,50.52 75.71,49.48 IC4.5
N$71  (via drill 0.4)
  Top 0.203: v70.16,43.47 70.16,40.58 70.51,40.23 70.51,37.98 80.27,28.21 80.27,16.25 81.49,15.04 JP34.1
  Bottom 0.203: v70.16,43.47 70.16,48.78 72.47,51.1 76.4,51.1 76.98,50.52 76.98,49.48 IC4.7
N$72  (via drill 0.4)
  Top 0.203: v69.81,38.62 69.81,38.15 79.92,28.04 79.92,4.06 81.49,2.5 JP36.1
  Bottom 0.203: v69.81,38.62 70.51,39.31 70.51,40.64 69.47,41.68 69.47,48.61 72.3,51.44 77.38,51.44 78.31,50.52 78.31,50.29 78.25,50.23 78.25,49.48 IC4.9
N$73  (via drill 0.4)
  Top 0.203: v90.15,47.4 90.15,50.23 89.81,50.58 89.81,59.53 94.03,63.75 94.49,63.75 95.24,64.5 95.24,88.77 94.03,89.99 JP39.1
  Bottom 0.203: v90.15,47.4 89.52,47.4 86.86,44.74 86.86,43.59 IC7.18
N$74  (via drill 0.4)
  Top 0.203: v88.19,45.09 88.19,49.83 89.11,50.75 89.11,72.59 93.97,77.45 JP41.1
  Bottom 0.203: v88.19,45.09 88.19,43.59 IC7.16
N$75  (via drill 0.4)
  Top 0.203: v89.46,45.09 89.46,60.46 93.97,64.97 JP43.1
  Bottom 0.203: v89.46,45.09 89.46,43.59 IC7.14
N$76
  Bottom 0.203: IC7.12 90.79,43.59 90.79,46.59 90.98,46.78 93.51,46.78 93.51,46.94 93.85,47.28 93.85,52.37 93.97,52.48 JP45.1
N$77  (via drill 0.4)
  Top 0.203: v90.85,48.09 94.2,44.74 97.2,44.74 97.55,45.09 101.36,45.09 106.45,40 JP49.1
  Bottom 0.203: v90.85,48.09 90.73,48.21 90.73,48.27 90.79,48.32 90.79,48.61 90.73,48.67 90.73,49.42 IC7.9
N$78  (via drill 0.4)
  Top 0.203: v84.09,43.35 84.09,37.4 93.97,27.52 JP51.1
  Bottom 0.203: v84.09,43.35 84.09,44.34 84.61,44.86 85.99,44.86 89.46,48.32 89.46,49.42 IC7.7
N$79  (via drill 0.4)
  Top 0.203: v83.1,43.35 83.1,42.83 83.74,42.2 83.74,25.27 93.97,15.04 JP53.1
  Bottom 0.203: v83.1,43.35 83.1,43.87 84.43,45.2 85.07,45.2 88.19,48.32 88.19,49.42 IC7.5
N$80  (via drill 0.4)
  Top 0.203: v82.06,43.35 83.39,42.02 83.39,13.07 93.97,2.5 JP57.1
  Bottom 0.203: v82.06,43.35 86.86,48.15 86.86,49.42 IC7.3
N$81  (via drill 0.4)
  Top 0.203: v99.17,41.74 96.16,41.74 v94.2,43.7 | v94.49,45.43 97.14,45.43 99.63,47.92 99.63,83.17 106.45,89.99 JP40.1
  Bottom 0.203: v99.17,41.74 99.4,41.97 99.4,43.01 IC3.18 | v94.2,43.7 94.2,45.15 v94.49,45.43
N$82  (via drill 0.4)
  Top 0.203: v100.15,45.78 100.15,47.17 99.98,47.34 99.98,70.97 106.45,77.45 JP42.1
  Bottom 0.203: v100.15,45.78 100.15,44.28 100.67,43.76 IC3.16
N$83  (via drill 0.4)
  Top 0.203: v102.58,45.38 102.58,61.09 106.45,64.97 JP44.1
  Bottom 0.203: v102.58,45.38 102,44.8 102,43.06 IC3.14
N$84
  Bottom 0.203: IC3.12 103.27,46.36 106.33,49.42 106.33,52.37 106.45,52.48 JP48.1
N$85
  Bottom 0.203: IC3.3 99.4,48.9 99.4,46.94 94.14,41.68 94.14,40.12 94.03,40 JP50.1
N$86  (via drill 0.4)
  Top 0.203: v100.67,47.63 100.67,46.3 105.7,41.27 106.97,41.27 107.72,40.52 107.72,28.73 106.51,27.52 JP52.1
  Bottom 0.203: v100.67,47.63 100.67,48.9 IC3.5
N$87  (via drill 0.4)
  Top 0.203: v101.07,44.39 101.54,44.39 105.23,40.7 105.23,16.25 106.45,15.04 JP54.1
  Bottom 0.203: v101.07,44.39 101.07,44.86 102,45.78 102,48.9 IC3.7
N$88  (via drill 0.4)
  Top 0.203: v95.18,43.7 101.71,43.7 104.89,40.52 104.89,4.06 106.45,2.5 JP58.1
  Bottom 0.203: v95.18,43.7 95.18,47.8 97.61,50.23 103.1,50.23 103.27,50.06 103.27,48.96 IC3.9
N$89  (via drill 0.25)
  Top 0.102: v72.36,55.49 77.04,55.49 78.13,56.59 78.13,56.76 IC1.15
  Bottom 0.102: IC6.19 10.7,43.53 10.7,42.49 10.53,42.31 9.66,42.31 9.02,42.95 9.02,47.34 10.12,48.44 10.12,49.42 IC6.1 10.06,49.48 10.06,50.46 15.84,56.24 53.75,56.24 56.87,59.36 68.83,59.36 69.18,59.01 69.18,56.82 70.97,55.03 71.89,55.03 v72.36,55.49
N$90  (via drill 0.25)
  Top 0.102: v68.6,57.97 69,58.38 74.2,58.38 75.59,56.99 75.59,56.82 IC1.13 | v35.49,53.76 35.49,51.85 v35.55,51.79
  Bottom 0.102: IC9.19 36.24,43.59 36.24,46.42 35.14,47.51 35.14,47.98 35.6,48.44 35.6,49.42 IC9.1 35.55,49.48 v35.55,51.79 | v68.6,57.97 68.6,55.26 36.99,55.26 v35.49,53.76
N$91  (via drill 0.25)
  Top 0.102: v61.26,44.34 61.26,46.94 v60.51,47.69 | v68.6,56.35 70.04,57.8 72.24,57.8 73.05,56.99 73.05,56.82 IC1.11
  Bottom 0.102: v61.26,44.34 61.26,43.06 IC8.19 | v60.51,47.69 60.51,47.86 60.57,47.92 60.57,48.9 IC8.1 60.57,48.96 60.57,49.94 61.38,50.75 63,50.75 v68.6,56.35
N$92  (via drill 0.25)
  Top 0.102: 24.22,46.76 24.22,47.74 v23.76,48.21 | 24.22,46.76 v24.22,45.43 | v68.6,58.78 75.07,58.78 76.86,56.99 76.86,56.82 IC1.14 | v26.13,54.04 23.24,54.04 v20.46,51.27 | 24.22,46.76 v20.46,46.76
  Bottom 0.102: v24.22,45.43 24.22,43.59 IC10.19 | v23.76,48.21 23.53,48.44 23.53,49.42 IC10.1 | v68.6,58.78 65.36,55.55 29.59,55.55 28.09,54.04 v26.13,54.04 | v20.46,46.76 v20.46,51.27
N$93  (via drill 0.25)
  Top 0.102: v93.79,46.01 94.2,46.01 96.11,47.92 v97.03,47.92 | v72.47,63.41 71.84,62.77 71.84,62.25 IC1.7 | v90.44,59.3 90.44,57.74 95.18,53 v95.18,51.39
  Bottom 0.102: v97.03,47.92 98.07,48.96 IC3.1 | IC3.19 98.7,43.01 98.7,42.43 98.13,41.85 98.07,41.85 94.72,38.5 93.45,38.5 92.52,39.42 92.52,43.5 92.52,44.5 91.88,44.5 91.1,45.28 91.1,46.5 93.79,46.5 | v72.47,63.41 77.5,63.41 80.85,66.76 82.99,66.76 v90.44,59.3 | v95.18,51.39 95.18,48.21 93.79,46.82 93.79,46.5 | v93.79,46.01 93.79,46.5
N$94  (via drill 0.25)
  Top 0.102: v68.6,57.16 69.52,58.09 73.22,58.09 74.32,56.99 74.32,56.82 IC1.12 | v48.78,54.56 48.78,53.7 48.61,53.52 48.61,47.86 v48.78,47.69
  Bottom 0.102: 48.81,47.66 49.07,47.92 49.07,48.9 IC5.1 | 48.81,47.66 48.32,47.17 48.32,42.14 48.66,41.79 49.47,41.79 49.7,42.02 49.7,43.01 IC5.19 | v68.6,57.16 66.4,54.97 49.18,54.97 v48.78,54.56 | v48.78,47.69 48.81,47.66
N$95  (via drill 0.25)
  Top 0.102: v76.28,47.17 76.28,47.4 71.78,51.91 71.78,56.76 IC1.10 | v73.05,48.21 73.05,48.03 v75.01,46.07
  Bottom 0.102: v76.28,47.17 75.1,45.98 | 75.1,45.98 73.74,44.62 73.74,43.59 IC4.19 | v73.05,48.21 73.11,48.27 73.11,49.42 IC4.1 | v75.01,46.07 75.07,46.01 75.1,45.98
N$98
  Top 0.102: J1.3 9.78,76.52 9.43,76.52 5.33,80.62 5.33,87.21 1.51,91.03 1.51,95.71 2.84,97.03 IC11.6
N$99  (via drill 0.25)
  Top 0.102: v1.97,98.19 1.22,97.44 1.22,82.53 9.43,74.33 9.78,74.33 J1.5
  Bottom 0.102: v1.97,98.19 1.97,98.59 1.51,99.06 1.51,100.33 2.84,101.66 2.84,102.12 IC11.4
N$100
  Top 0.102: J1.2 9.83,77.62 10.18,77.62 11.16,78.6 11.16,91.14 11.57,91.55 11.57,93.45 10.53,94.49 IC11.10
N$102  (via drill 0.25)  (2 unrouted)
  Top 0.102: v9.31,49.88 9.31,47.86 7.64,46.19 7.64,26.02 7.52,25.9 7.52,23.07 7.64,22.96 7.64,18.04 6.54,16.95 B_RIGHT.2
  Bottom 0.102: 45.31,59.99 45.08,59.99 41.61,56.53 15.5,56.53 9.31,50.34 v9.31,49.88
Y1  (via drill 0.25)
  Top 0.102: v51.21,46.24 51.55,46.24 53.58,48.27 58.78,48.27 v60.11,46.94 | v23.64,47.34 v21.04,47.34 | v35.72,47.74 33.58,47.74 v28.67,52.66 | 47.05,46.88 44.85,46.88 42.6,49.13 v42.19,49.13 | 47.05,46.88 v49.01,46.88 | v72.7,47.05 72.18,47.05 67.5,42.37 66.35,42.37 66,42.02 66,41.22 69.18,38.04 v69.18,37.92 | v54.21,22.96 48.95,22.96 47.85,24.05 47.85,24.17 IC2.15 | v80.21,44.05 80.21,42.83 v80.5,42.55 | v98.53,47.69 98.07,47.69 97.26,48.5 94.03,48.5 v92.29,50.23 | v90.44,53.7 v91.66,52.48 | v47.05,45.66 47.05,46.88
  Bottom 0.102: v51.21,46.24 49.79,47.66 | 49.79,47.66 49.76,47.69 49.76,48.9 IC5.2 | v60.11,46.94 60.57,46.94 61.2,47.57 61.2,48.9 IC8.2 | 21.01,52.57 21.04,52.54 v21.04,47.34 | 21.01,52.57 19.6,53.99 14.23,53.99 10.76,50.52 10.76,49.48 IC6.2 | v23.64,47.34 23.93,47.63 23.99,47.63 24.34,47.98 24.34,48.44 24.28,48.5 24.28,49.42 IC10.2 | v35.72,47.74 36.15,48.18 | 36.15,48.18 36.24,48.27 36.24,49.42 IC9.2 | v28.67,52.66 21.1,52.66 21.04,52.6 21.01,52.57 | v49.01,46.88 49.76,47.63 49.79,47.66 | v42.19,49.13 42.25,49.07 42.25,48.78 40.11,46.65 37.69,46.65 36.18,48.15 36.15,48.18 | v72.7,47.05 73.74,48.09 73.74,49.42 IC4.2 | v54.21,22.96 58.75,27.49 | 58.75,27.49 68.34,37.08 | 68.34,37.08 v69.18,37.92 | 86.08,50.6 85.99,50.69 85.13,50.69 80.56,46.13 80.56,44.39 v80.21,44.05 | 86.08,50.6 86.22,50.46 86.22,49.48 IC7.2 | v80.5,42.55 76.05,38.09 71.89,38.09 69.87,36.07 69.35,36.07 68.37,37.05 68.34,37.08 | v98.53,47.69 98.7,47.86 98.7,48.9 IC3.2 | v92.29,50.23 92.29,50.4 91.89,50.81 91.71,50.81 91.37,51.15 91.37,52.2 v91.66,52.48 | v90.44,53.7 88.02,51.27 86.74,51.27 86.11,50.63 86.08,50.6 | v47.05,45.66 47.05,39.19 58.72,27.52 58.75,27.49
Y2  (via drill 0.25)
  Top 0.102: v51.38,47.69 52.65,47.69 53.78,48.81 | 53.78,48.81 53.81,48.84 61.03,48.84 v62.36,50.17 62.36,50.11 62.88,49.59 63.86,49.59 66.17,51.91 v66.46,51.91 | v72.36,49.59 71.2,49.59 70.28,50.52 v67.85,50.52 | v87.32,50.69 79.29,58.72 v77.44,58.72 | v97.32,49.07 94.26,49.07 v93.1,50.23 | v90.44,52.89 v91.94,51.39 | v15.38,52.08 16.88,52.08 19.66,54.85 v26.13,54.85 | v36.7,51.21 35.32,51.21 35.3,51.21 34.91,51.61 34.91,54.66 34.72,54.85 31.67,54.85 v28.09,54.85 v28.09,47.23 | v24.97,47.34 26.07,47.34 v26.13,47.28 | v47.57,26.31 49.7,26.31 50.92,25.09 50.92,23.36 50.8,23.25 49.94,23.25 49.13,24.05 49.13,24.17 IC2.14 | v40.05,28.96 40.05,29.08 34.56,34.57 34.56,41.04 v31.44,44.16 | v51.55,52.25 53.75,50.06 53.75,48.84 53.78,48.81
  Bottom 0.102: v51.38,47.69 51.26,47.69 51.03,47.92 51.03,48.9 IC5.4 | v62.36,50.17 62.47,50.06 62.47,48.96 IC8.4 | v72.36,49.59 72.36,50 72.76,50.4 74.67,50.4 75.01,50.06 75.01,49.48 IC4.4 | v66.46,51.91 v67.85,50.52 67.85,50.58 69.29,50.58 v77.44,58.72 | IC7.4 87.5,49.48 87.5,50.52 v87.32,50.69 87.44,50.63 87.5,50.69 88.25,50.69 v90.44,52.89 | v97.32,49.07 97.32,49.48 97.72,49.88 99.69,49.88 99.98,49.59 99.98,48.96 IC3.4 | v91.94,51.39 v93.1,50.23 | v15.38,52.08 13.65,52.08 12.03,50.46 12.03,49.48 IC6.4 | v28.09,54.85 v26.13,54.85 | v36.7,51.21 37.22,50.69 37.28,50.69 37.51,50.46 37.51,49.48 IC9.4 | v24.97,47.34 25.49,47.86 25.49,49.42 IC10.4 | v26.13,47.28 28.03,47.28 v28.09,47.23 28.38,47.23 v31.44,44.16 | v47.57,26.31 44.91,28.96 42.54,28.96 | v40.05,28.96 42.54,28.96 | v51.55,52.25 51.26,51.96 49.36,51.96 46.01,48.61 46.01,44.1 42.54,40.64 42.54,28.96
Y3  (via drill 0.25)
  Top 0.102: v100.61,50.87 100.61,48.55 101.36,47.8 v101.36,47.05 | v63.63,50.17 63.05,50.75 62.13,50.75 60.8,49.42 v55.71,49.42 55.54,49.42 v51.55,53.41 | v74.67,47.74 74.67,48.21 70.22,52.66 70.22,52.95 69.35,53.81 v68.25,53.81 | v87.9,57.11 81.25,57.11 79.06,59.3 76.98,59.3 v76.63,58.95 | v14.63,51.5 14.63,52.14 18.15,55.66 v26.13,55.66 | v28.09,55.66 34.39,55.66 36.7,53.35 v36.7,52.6 | v47.16,25.56 49.18,25.56 50.34,24.4 50.34,24.23 IC2.13 | v44.33,26.02 43.81,26.02 37.92,31.91 37.92,50.06 v38.55,50.69 39.07,50.69 42.54,54.16 v42.54,54.56
  Bottom 0.102: 91.68,53.32 92.35,53.99 94.6,53.99 97.72,50.87 v100.61,50.87 | 91.68,53.32 88.88,50.52 88.88,49.48 IC7.6 | v101.36,47.05 101.36,48.9 IC3.6 | v55.71,49.42 55.77,49.36 55.77,48.27 54.5,46.99 53.23,46.99 52.36,47.86 52.36,48.9 IC5.6 | IC8.6 63.86,48.96 63.86,49.94 v63.63,50.17 63.75,50.11 66.11,52.48 66.92,52.48 v68.25,53.81 68.43,53.99 71.66,53.99 v76.63,58.95 | v74.67,47.74 75.65,47.74 76.28,48.38 76.28,49.42 IC4.6 | v87.9,57.11 91.66,53.35 91.68,53.32 | v14.63,51.5 14.34,51.5 13.36,50.52 13.36,49.48 IC6.6 | v28.09,55.66 v26.13,55.66 | 38.58,50.72 38.84,50.46 38.84,49.48 IC9.6 | 38.58,50.72 v36.7,52.6 36.7,52.54 35.49,52.54 30.75,47.8 27.4,47.8 26.88,48.32 26.88,49.42 IC10.6 | v47.16,25.56 46.7,26.02 v44.33,26.02 | v38.55,50.69 38.58,50.72 | v51.55,53.41 51.44,53.29 45.66,53.29 44.39,54.56 v42.54,54.56
Y4  (via drill 0.25)
  Top 0.102: v90.44,50.81 98.36,50.81 v98.99,51.44 | v75.01,46.94 74.67,46.94 74.09,47.51 74.09,47.98 73.28,48.78 71.66,48.78 70.45,50 68.83,50 68.77,49.94 v67.27,49.94 67.27,45.26 65.77,43.76 62.94,43.76 61.55,45.15 61.55,47.46 60.74,48.27 v59.82,48.27 | v14.86,50.69 24.74,50.69 v26.13,52.08 | v48.95,27.69 51.61,25.04 51.61,24.23 IC2.12 | v47.91,28.73 47.91,42.2 40.4,49.71 v40.4,50.69 | v78.77,55.55 78.77,48.96 v78.02,48.21
  Bottom 0.102: v90.44,50.81 90.15,50.52 90.15,49.48 IC7.8 | IC3.8 102.64,48.9 102.64,47.92 102.98,47.57 104.08,47.57 104.77,48.27 104.77,49.94 103.27,51.44 v98.99,51.44 97.49,51.44 82.47,66.47 80.91,66.47 78.77,64.33 v78.77,55.55 | v67.27,49.94 66.92,50.29 65.42,50.29 65.13,50 65.13,48.96 IC8.8 | v75.01,46.94 75.25,46.94 76.52,48.21 77.44,48.21 77.53,48.29 | 77.53,48.29 77.67,48.44 77.67,49.42 IC4.8 | v14.86,50.69 14.63,50.46 14.63,49.48 IC6.8 | v26.13,52.08 28.61,52.08 30.26,50.43 | 30.26,50.43 30.29,50.4 30.29,48.44 29.94,48.09 28.44,48.09 28.09,48.44 28.09,49.42 IC10.8 | 38.58,51.99 37.4,53.18 34.28,53.18 31.56,50.46 30.29,50.46 30.26,50.43 | 38.58,51.99 39.97,50.6 | 39.97,50.6 40.11,50.46 40.11,49.48 IC9.8 | 53.26,51.36 51.78,52.83 45.77,52.83 44.62,53.99 40.57,53.99 38.61,52.02 38.58,51.99 | 53.26,51.36 53.63,50.98 53.63,48.96 IC5.8 | v47.91,28.73 v48.95,27.69 | v40.4,50.69 40.05,50.69 40,50.63 39.97,50.6 | v59.82,48.27 59.82,51.27 57.1,53.99 55.89,53.99 53.29,51.39 53.26,51.36 | v78.02,48.21 77.61,48.21 77.56,48.27 77.53,48.29
Y5  (via drill 0.25)
  Top 0.102: v16.65,42.83 24.8,42.83 v25.32,42.31 | v66.58,41.79 67.62,41.79 70.62,44.8 v74.72,44.8 | v44.39,46.53 45.37,46.53 46.81,45.09 48.49,45.09 | v48.95,45.09 48.49,45.09 | v49.76,27.98 52.88,24.86 52.88,24.23 IC2.11 | 48.49,45.09 48.49,37.75 | 48.49,37.75 v48.49,29.31 | 48.49,37.75 v49.3,37.75 | v91.42,40.7 87.9,40.7 v84.78,37.58 | v77.15,29.95 74.38,29.95 v64.56,39.77
  Bottom 0.102: IC7.11 91.42,43.53 v91.42,40.7 91.42,40.17 93.39,38.21 96.51,38.21 99.98,41.68 99.98,43.01 IC3.17 | v16.65,42.83 15.96,43.53 IC6.11 | IC10.17 25.55,43.53 25.55,42.55 v25.32,42.31 25.43,42.37 26.3,41.5 38.38,41.5 38.49,41.39 40.98,41.39 45.72,46.13 45.72,47.74 45.31,48.15 44.85,48.15 44.39,47.69 v44.39,46.53 41.44,43.59 IC9.11 | v74.72,44.8 74.84,44.8 75.07,44.57 75.07,43.59 IC4.17 | IC8.11 66.46,43.01 66.46,41.91 v66.58,41.79 66.46,41.85 64.47,39.86 | v48.95,45.09 51.03,45.09 51.55,44.57 51.55,44.22 51.03,43.7 51.03,43.06 IC5.17 | v49.76,27.98 48.49,29.25 v48.49,29.31 | 64.47,39.86 62.36,37.75 v49.3,37.75 | v77.15,29.95 v84.78,37.58 | v64.56,39.77 64.5,39.83 64.47,39.86
Y6  (via drill 0.25)
  Top 0.102: v14.63,46.19 19.08,46.19 21.68,48.78 25.38,48.78 v26.07,48.09 | 40.17,40.23 40.17,39.48 v44.73,34.92 | 40.17,40.23 v40.17,42.31 | v51.09,28.21 51.09,27.46 54.15,24.4 54.15,24.23 IC2.10 | v27.52,42.08 27.52,41.74 v29.71,39.54 | 40.17,40.23 v39.42,40.23 | v101.07,41.79 100.38,41.1 96.39,41.1 95.18,42.31 v90.33,42.31 85.94,42.31 v84.72,41.1 | v77.5,47.57 77.5,47.8 v72.41,52.89 | v69.06,49.42 69.06,44.74 v67.27,42.95 | 65.48,40 65.13,40 64.79,40.35 v63.46,40.35 | 65.48,40 v65.59,40 65.48,40 | v75.19,31.57 73.92,31.57 65.48,40 | v51.84,30.76 51.84,34.57 v55.77,38.5
  Bottom 0.102: v14.63,46.19 14.63,43.59 IC6.13 | v26.07,48.09 25.55,47.57 25.55,46.99 26.82,45.72 26.82,43.59 IC10.15 26.88,43.53 26.88,42.49 27.28,42.08 v27.52,42.08 | v40.17,42.31 40.17,43.53 IC9.13 | 50.37,29.28 51.09,28.56 v51.09,28.21 | 50.37,29.28 v44.73,34.92 | v29.71,39.54 29.88,39.54 30.92,38.5 37.69,38.5 v39.42,40.23 | v90.33,42.31 90.15,42.49 90.15,43.53 IC7.13 | v101.07,41.79 101.36,42.08 101.36,43.01 IC3.15 | 55.8,38.53 55.83,38.5 61.61,38.5 v63.46,40.35 65.08,41.97 65.08,43.01 IC8.13 | 55.8,38.53 52.36,41.97 52.36,43.01 IC5.15 | v77.5,47.57 76.34,46.42 76.34,43.59 IC4.15 | v72.41,52.89 69.06,49.54 v69.06,49.42 | v67.27,42.95 67.27,41.68 v65.59,40 | v75.19,31.57 v84.72,41.1 | v51.84,30.76 50.4,29.31 50.37,29.28 | v55.77,38.5 55.8,38.53
Y7  (via drill 0.25)
  Top 0.102: v13.53,42.31 15.32,42.31 16.59,43.59 v30.87,43.59 33.64,40.81 v33.99,40.81 | v38.84,42.31 v38.84,40.81 38.84,40 v44.73,34.11 | v50.05,28.79 51.32,28.79 55.42,24.69 55.42,24.23 IC2.9 | v77.61,44.8 77.61,46.65 72.41,51.85 v72.41,52.08 | v63.75,41.79 65,41.79 | 65,41.79 65.08,41.79 65.41,41.46 68.6,38.27 68.6,37.69 68.95,37.34 70.22,37.34 76.57,30.99 v76.57,30.52 | v53.11,29.43 53.11,34.92 57.68,39.48 57.68,41.1 v57.33,41.45 | 65,41.79 65.26,42.05 65.63,42.05 66.69,43.11 66.69,43.19 67.03,43.53 67.45,43.53 68.21,44.29 68.48,44.56 v68.48,48.03
  Bottom 0.102: v13.53,42.31 13.36,42.49 13.36,43.53 IC6.15 | v30.87,43.59 30.87,44.28 30,45.15 28.67,45.15 28.09,44.57 28.09,43.59 IC10.13 | v38.84,42.31 38.84,43.53 IC9.15 | v33.99,40.81 v38.84,40.81 | v44.73,34.11 v50.05,28.79 50.05,28.5 50.51,28.04 50.51,27.98 50.86,27.64 51.32,27.64 v53.11,29.43 | 88.91,42.34 88.88,42.37 88.88,43.53 IC7.15 | 88.91,42.34 93.33,37.92 98.53,37.92 102.58,41.97 102.58,43.01 IC3.13 | 57.33,41.5 63.28,41.5 63.66,41.88 | 57.33,41.5 54.15,41.5 53.63,42.02 53.63,43.01 IC5.13 | 63.66,41.88 63.86,42.08 63.86,43.01 IC8.15 | v77.61,44.8 77.67,44.74 77.67,43.59 IC4.13 | v72.41,52.08 72.41,51.96 v68.48,48.03 | v63.75,41.79 63.69,41.85 63.66,41.88 | v76.57,30.52 88.36,42.31 88.88,42.31 88.91,42.34 | 57.33,41.5 v57.33,41.45
Y8  (via drill 0.25)
  Top 0.102: v79.64,43.41 79.64,42.6 80.5,41.74 v82.76,41.74 | v103.21,41.33 101.42,41.33 100.9,40.81 94.89,40.81 93.97,41.74 v86.92,41.74 | v12.49,42.31 12.72,42.31 13.3,41.74 22.08,41.74 22.37,42.02 24.8,42.02 25.09,41.74 26.36,41.74 27.28,42.66 28.84,42.66 v29.19,42.31 29.19,40.87 30.29,39.77 30.29,37.92 42.89,25.32 v43.58,25.32 | v55.83,22.96 54.21,21.34 54.21,18.8 IC2.7 | v57.45,24.57 57.45,26.77 57.97,27.29 57.97,41.62 v57.27,42.31
  Bottom 0.102: v79.64,43.41 79.52,43.53 78.94,43.53 IC4.11 | 86.83,41.82 87.55,42.55 87.55,43.53 IC7.17 | 86.83,41.82 86.74,41.74 v82.76,41.74 80.04,41.74 62.88,24.57 v57.45,24.57 v55.83,22.96 55.25,22.38 46.53,22.38 v43.58,25.32 | v103.21,41.33 103.91,42.02 103.91,43.01 IC3.11 | v86.92,41.74 86.86,41.79 86.83,41.82 | v12.49,42.31 12.26,42.31 12.03,42.55 12.03,43.53 IC6.17 | IC10.11 29.42,43.53 29.42,42.55 v29.19,42.31 29.31,42.37 29.36,42.31 37.34,42.31 37.51,42.49 37.51,43.53 IC9.17 | 57.3,42.34 57.85,41.79 62.3,41.79 62.47,41.97 62.47,43.01 IC8.17 | 57.3,42.34 57.04,42.6 55.37,42.6 54.96,43.01 IC5.11 | v57.27,42.31 57.3,42.34
Z0  (1 unrouted)
  Top 0.102: IC12.3 44.56,96 29.83,96 27.23,98.59 27.23,101.83 33.64,108.25 U$2.D8
Z1  (1 unrouted)
  Top 0.102: IC12.2 42.19,96.63 40.75,98.08 40.75,105.24 37.74,108.25 U$2.D7
Z2  (1 unrouted)
  Top 0.102: IC12.1 44.56,97.32 44.56,98.71 43.29,99.98 43.29,105.24 40.28,108.25 U$2.D6

## Text on the board
tNames: 7 | 8 | 5 | 6 | 3 | 4 | 1 | 2 | 22k | 22k | Z | CD74HC4050E | 22k | 22k | 22k | 22k | 22k | 22k | 74VHC238FT | SN74HC138DR | + | X | - | 100k | 74VHC238FT | Y | Made by Dominik Chraca / chdominik0@gmail.com
tValues: 6/3/2019